# Altium schematic sheet MB_audio.SchDoc: Материнская плата
size 420 x 297 mm; DrawnBy: В.Титов; DocumentNumber: ХХХХ.468179.001 Э3; SheetNumber: 7; SheetTotal: 7; DocumentType: Схема электрическая принципиальная; Title2: Питание процессора
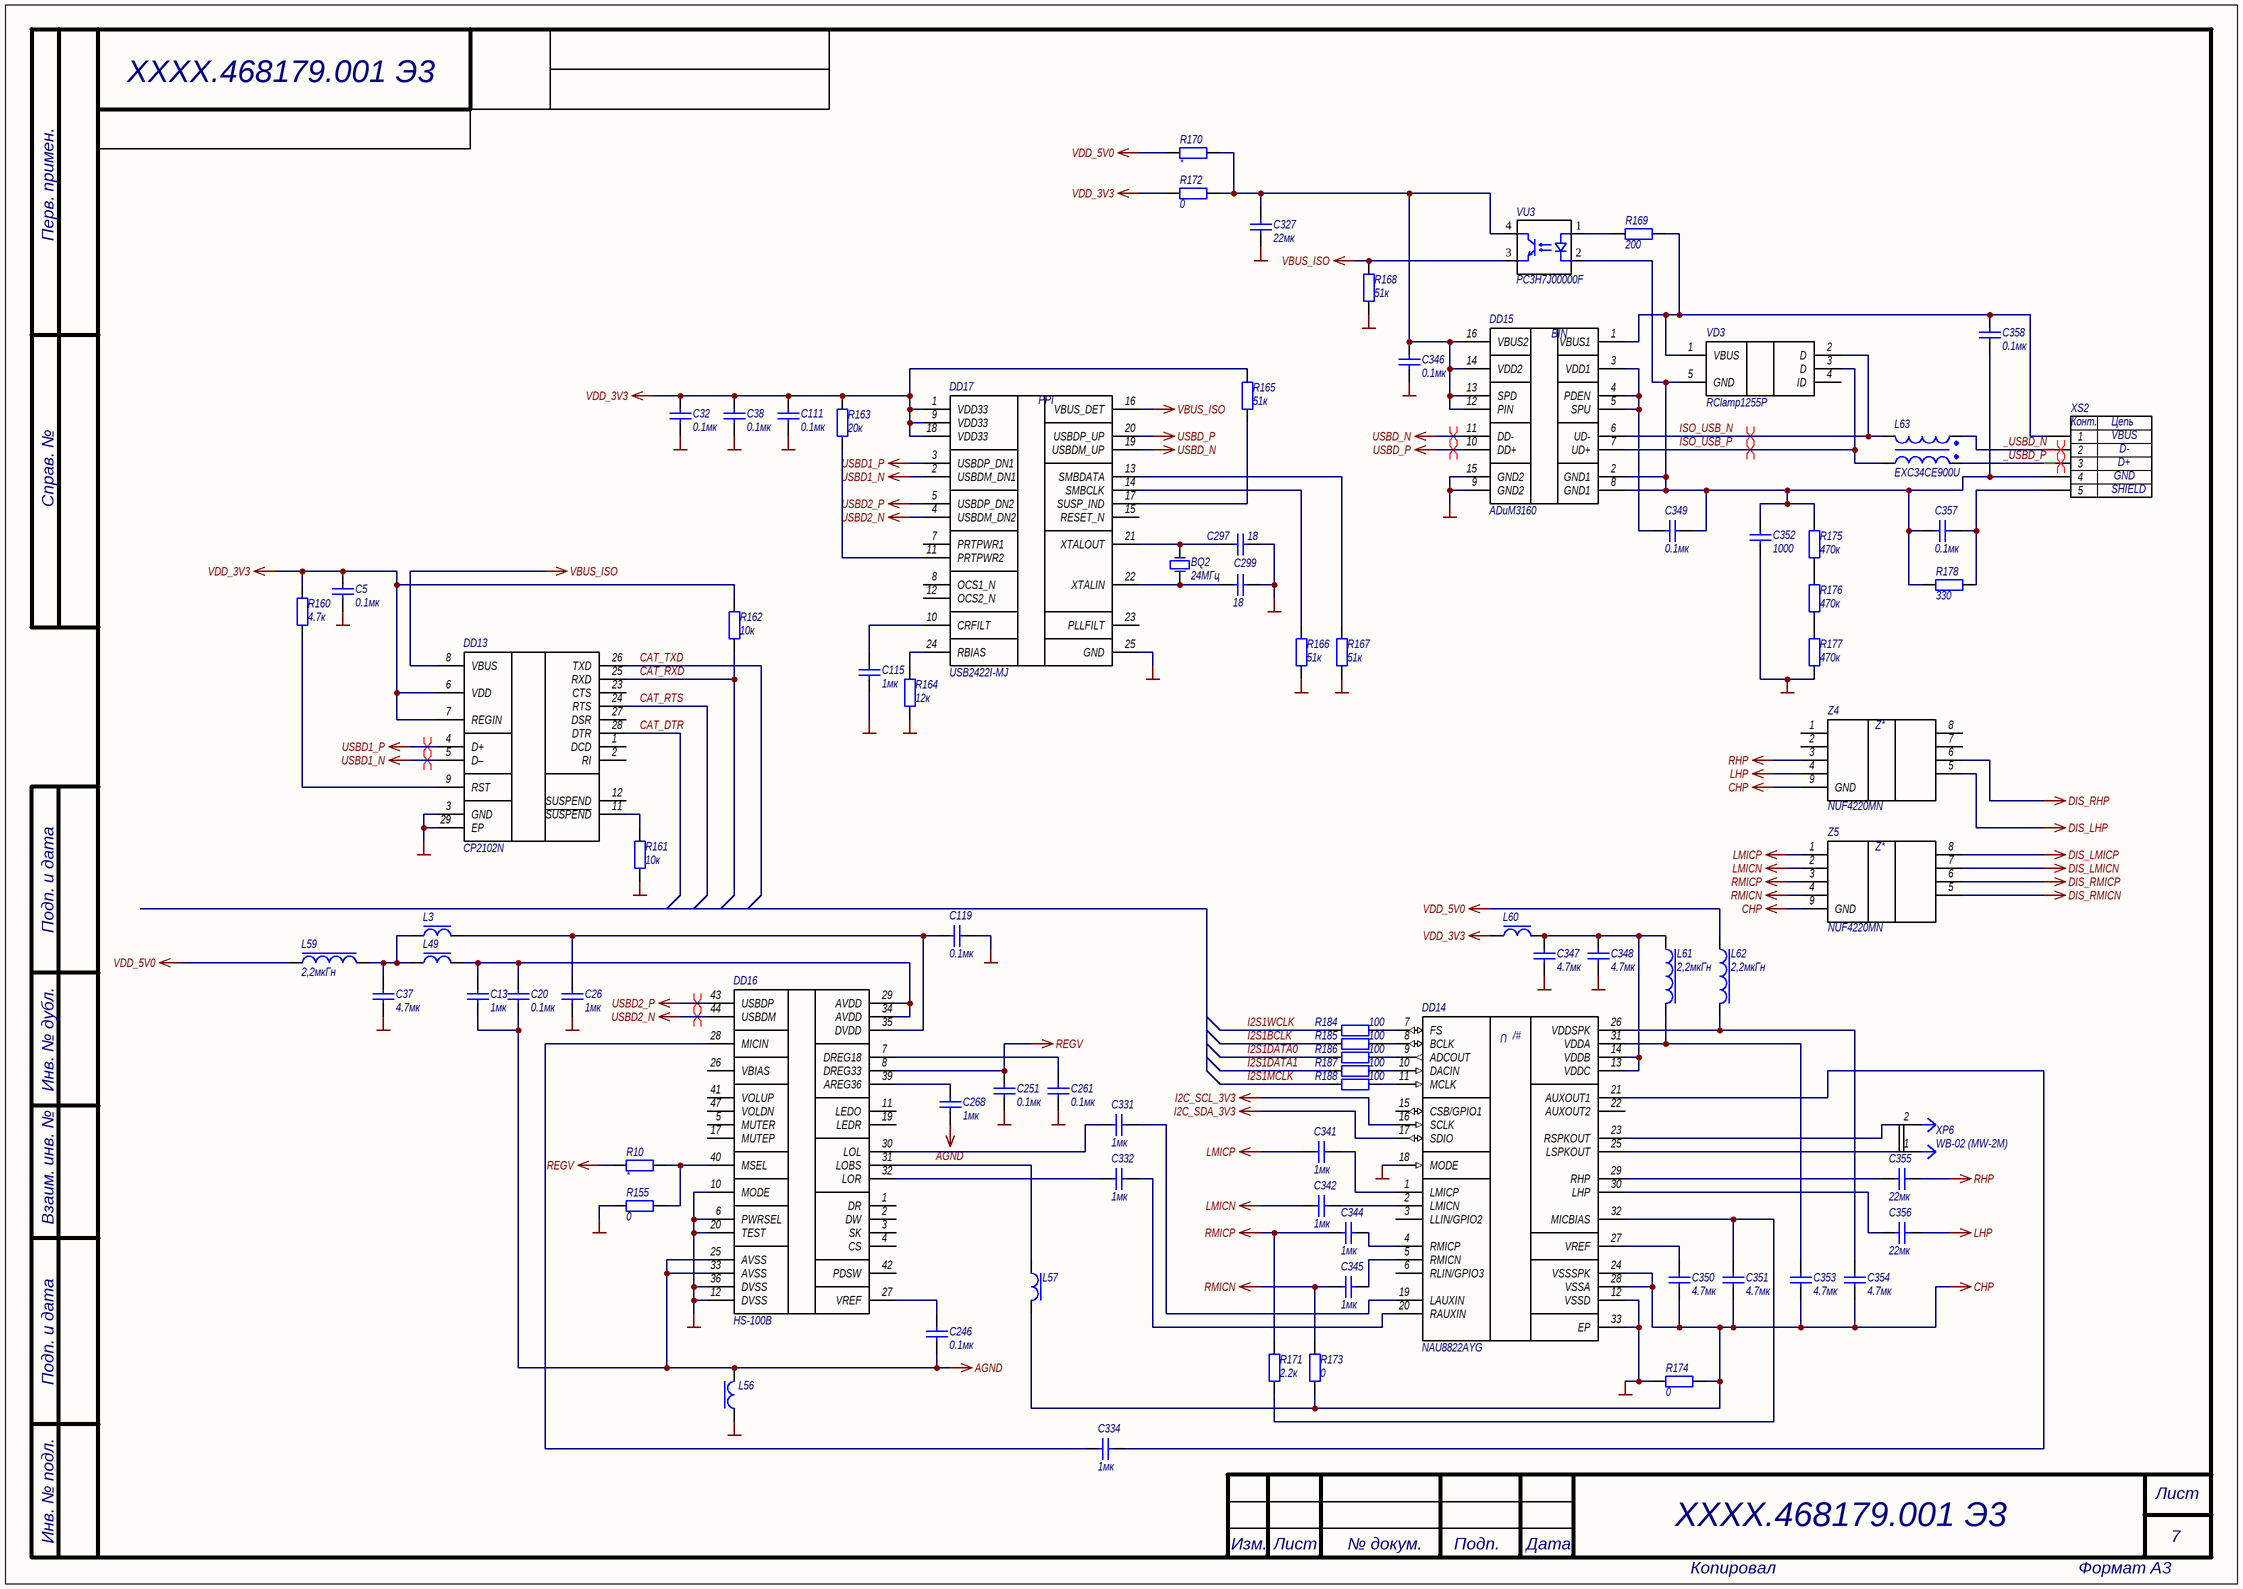
[diagram p0: MB_audio.SchDoc]

## Parts
BQ2  24МГц  [ABRACOM ABM10]
C5  0.1мк  [CAPC1005X06N]
C13  1мк  [CAPC1005X06N]
C20  0.1мк  [CAPC1005X06N]
C26  1мк  [CAPC1005X06N]
C32  0.1мк  [CAPC1005X06N]
C37  4.7мк  [CAPC2012X12L]
C38  0.1мк  [CAPC1005X06N]
C111  0.1мк  [CAPC1005X06N]
C115  1мк  [CAPC1005X06N]
C119  0.1мк  [CAPC1005X06N]
C246  0.1мк  [CAPC1005X06N]
C251  0.1мк  [CAPC1005X06N]
C261  0.1мк  [CAPC1005X06N]
C268  1мк  [CAPC1005X06N]
C297  18  [CAPC1005X06N]
C299  18  [CAPC1005X06N]
C327  22мк  [CAPC2012X12L]
C331  1мк  [CAPC1005X06N]
C332  1мк  [CAPC1005X06N]
C334  1мк  [CAPC1005X06N]
C341  1мк  [CAPC1005X06N]
C342  1мк  [CAPC1005X06N]
C344  1мк  [CAPC1005X06N]
C345  1мк  [CAPC1005X06N]
C346  0.1мк  [CAPC1005X06N]
C347  4.7мк  [CAPC2012X12L]
C348  4.7мк  [CAPC2012X12L]
C349  0.1мк  [CAPC1608X08L]
C350  4.7мк  [CAPC2012X12L]
C351  4.7мк  [CAPC2012X12L]
C352  1000  [CAPRD7.5-9x5]
C353  4.7мк  [CAPC2012X12L]
C354  4.7мк  [CAPC2012X12L]
C355  22мк  [CAPC2012X12L]
C356  22мк  [CAPC2012X12L]
C357  0.1мк  [CAPC1608X08L]
C358  0.1мк  [CAPC1608X08L]
DD13  CP2102N  [QFN50P500X500X80_HS-29N]
DD14  NAU8822AYG  [QFN50P500X500X100_HS-33L]
DD15  ADuM3160  [SOIC127P1030X265-16N]
DD16  HS-100B  [TSQFP50P900X900X160-48N]
DD17  USB2422I-MJ  [QFN50P400X400X80_HS-25L]
L3  BLM18PG121SN1D  [INDC1608X08L]  (value not drawn)
L49  BLM18PG121SN1D  [INDC1608X08L]  (value not drawn)
L56  BLM18PG121SN1D  [INDC1608X08L]  (value not drawn)
L57  BLM18PG121SN1D  [INDC1608X08L]  (value not drawn)
L59  2,2мкГн  [CSAB0420]
L60  BLM18PG121SN1D  [INDC1608X08L]  (value not drawn)
L61  2,2мкГн  [CSAB0420]
L62  2,2мкГн  [CSAB0420]
L63  EXC34CE900U  [EXC34CE900U]
R10  *  [RESC1005X06N]
R155  0  [RESC1005X06N]
R160  4.7к  [RESC1005X06N]
R161  10к  [RESC1005X06N]
R162  10к  [RESC1005X06N]
R163  20к  [RESC1005X06N]
R164  12к  [RESC1005X06N]
R165  51к  [RESC1005X06N]
R166  51к  [RESC1005X06N]
R167  51к  [RESC1005X06N]
R168  51к  [RESC1005X06N]
R169  200  [RESC1005X06N]
R170  *  [RESC1005X06N]
R171  2.2к  [RESC1005X06N]
R172  0  [RESC1005X06N]
R173  0  [RESC1005X06N]
R174  0  [RESC1005X06N]
R175  470к  [RESC1005X06N]
R176  470к  [RESC1005X06N]
R177  470к  [RESC1005X06N]
R178  330  [RESC1005X06N]
R184  100  [RESC1005X06N]
R185  100  [RESC1005X06N]
R186  100  [RESC1005X06N]
R187  100  [RESC1005X06N]
R188  100  [RESC1005X06N]
VD3  RClamp1255P  [SLP2018P6]
VU3  PC3H7J00000F  [SO4-170-1.27]
XP6  WB-02 (MW-2M)  [WB-02 (MW-2M) pitch 2.00mm]
XS2  USBB-1J  [USB2.5-2H4D]  (value not drawn)
Z4  NUF4220MN  [QFN50P200X200X80_HS-9L]
Z5  NUF4220MN  [QFN50P200X200X80_HS-9L]

## Nets
AGND: C13.1 C20.1 C246.1 C268.1 DD16.25(AVSS) DD16.33(AVSS) L56.2
CHP: C350.2 C351.2 C353.2 C354.2 DD14.24(VSSSPK) DD14.28(VSSA) L57.2 R173.1 R174.2 Z4.9(GND) Z5.9(GND)
DIS_LHP: Z4.5
DIS_LMICN: Z5.7
DIS_LMICP: Z5.8
DIS_RHP: Z4.6
DIS_RMICN: Z5.5
DIS_RMICP: Z5.6
GND: C5.1 C26.2 C32.1 C37.2 C38.1 C111.1 C115.1 C119.1 C251.1 C261.1 C297.2 C299.2 C327.1 C346.1 C347.2 C348.2 C352.2 DD13.3(GND) DD13.29(EP) DD14.12(VSSD) DD14.18(MODE) DD14.33(EP) DD15.9(GND2) DD15.15(GND2) DD16.6(PWRSEL) DD16.10(MODE) DD16.12(DVSS) DD16.20(TEST) DD16.36(DVSS) DD17.25(GND) L56.1 R155.2 R161.1 R164.1 R166.1 R167.1 R168.1 R174.1 R177.1
I2C_SCL_3V3: DD14.16(SCLK)
I2C_SDA_3V3: DD14.17(SDIO)
LHP: C356.1 Z4.4
LMICN: C342.1 Z5.2
LMICP: C341.1 Z5.1
REGV: C251.2 DD16.8(DREG33) R10.2
RHP: C355.1 Z4.3
RMICN: C345.1 R173.2 Z5.4
RMICP: C344.1 R171.2 Z5.3
USBD1_N: DD13.5(D–) DD17.2(USBDM_DN1)
USBD1_P: DD13.4(D+) DD17.3(USBDP_DN1)
USBD2_N: DD16.44(USBDM) DD17.4(USBDM_DN2)
USBD2_P: DD16.43(USBDP) DD17.5(USBDP_DN2)
USBD_N: DD15.11(DD-) DD17.19(USBDM_UP)
USBD_P: DD15.10(DD+) DD17.20(USBDP_UP)
VBUS_ISO: DD13.8(VBUS) DD17.16(VBUS_DET) R168.2 VU3.3(E)
VDD_3V3: C5.2 C32.2 C38.2 C111.2 DD13.6(VDD) DD13.7(REGIN) DD17.1(VDD33) DD17.9(VDD33) DD17.18(VDD33) L60.1 R160.2 R162.2 R163.2 R165.2 R172.2
VDD_5V0: L59.1 L62.1 R170.2
_USBD_N: L63.1 XS2.2
_USBD_P: L63.4 XS2.3
CAT_DTR: DD13.28(DTR)
CAT_RTS: DD13.24(RTS)
CAT_RXD: DD13.25(RXD) R162.1
CAT_TXD: DD13.26(TXD)
I2S1BCLK: R185.1
I2S1DATA0: R186.1
I2S1DATA1: R187.1
I2S1MCLK: R188.1
I2S1WCLK: R184.1
ISO_USB_N: DD15.6(UD-) L63.2 VD3.2(D)
ISO_USB_P: DD15.7(UD+) L63.3 VD3.3(D)
NetBQ2_1: BQ2.1(OSC1) C297.1 DD17.21(XTALOUT)
NetBQ2_3: BQ2.3(OSC2) C299.1 DD17.22(XTALIN)
NetC13_2: C13.2 C20.2 DD16.29(AVDD) DD16.34(AVDD) L49.2
NetC26_1: C26.1 C119.2 DD16.35(DVDD) L3.2
NetC37_1: C37.1 L3.1 L49.1 L59.2
NetC115_2: C115.2 DD17.10(CRFILT)
NetC246_2: C246.2 DD16.27(VREF)
NetC261_2: C261.2 DD16.7(DREG18)
NetC268_2: C268.2 DD16.39(AREG36)
NetC327_2: C327.2 C346.2 DD15.12(PIN) DD15.13(SPD) DD15.14(VDD2) DD15.16(VBUS2) R170.1 R172.1 VU3.4(C)
NetC331_1: C331.1 DD16.30(LOL)
NetC331_2: C331.2 DD14.19(LAUXIN)
NetC332_1: C332.1 DD16.32(LOR)
NetC332_2: C332.2 DD14.20(RAUXIN)
NetC334_1: C334.1 DD16.28(MICIN)
NetC334_2: C334.2 DD14.21(AUXOUT1)
NetC341_2: C341.2 DD14.1(LMICP)
NetC342_2: C342.2 DD14.2(LMICN)
NetC344_2: C344.2 DD14.4(RMICP)
NetC345_2: C345.2 DD14.5(RMICN)
NetC347_1: C347.1 C348.1 DD14.13(VDDC) DD14.14(VDDB) L60.2 L61.1
NetC349_1: C349.1 C352.1 C357.2 C358.1 DD15.2(GND1) DD15.8(GND1) R175.2 R178.2 VD3.5(GND) VU3.2(K) XS2.4
NetC349_2: C349.2 DD15.3(VDD1) DD15.4(PDEN) DD15.5(SPU)
NetC350_1: C350.1 DD14.27(VREF)
NetC351_1: C351.1 DD14.32(MICBIAS) R171.1
NetC353_1: C353.1 DD14.31(VDDA) L61.2
NetC354_1: C354.1 DD14.26(VDDSPK) L62.2
NetC355_2: C355.2 DD14.29(RHP)
NetC356_2: C356.2 DD14.30(LHP)
NetC357_1: C357.1 R178.1 XS2.5
NetC358_2: C358.2 DD15.1(VBUS1) R169.1 VD3.1(VBUS) XS2.1
NetDD13_9: DD13.9(RST) R160.1
NetDD13_11: DD13.11(~{SUSPEND}) R161.2
NetDD14_7: DD14.7(FS) R184.2
NetDD14_8: DD14.8(BCLK) R185.2
NetDD14_9: DD14.9(ADCOUT) R186.2
NetDD14_10: DD14.10(DACIN) R187.2
NetDD14_11: DD14.11(MCLK) R188.2
NetDD14_23: DD14.23(RSPKOUT) XP6.2
NetDD14_25: DD14.25(LSPKOUT) XP6.1
NetDD16_31: DD16.31(LOBS) L57.1
NetDD16_40: DD16.40(MSEL) R10.1 R155.1
NetDD17_11: DD17.11(PRTPWR2) R163.1
NetDD17_13: DD17.13(SMBDATA) R167.2
NetDD17_14: DD17.14(SMBCLK) R166.2
NetDD17_17: DD17.17(SUSP_IND) R165.1
NetDD17_24: DD17.24(RBIAS) R164.2
NetR169_2: R169.2 VU3.1(A)
NetR175_1: R175.1 R176.2
NetR176_1: R176.1 R177.2

Not connected (* = marked no-connect by the designer): DD13 1(DCD) 2(RI) 12(SUSPEND) 23(CTS) 27(DSR); DD14 3(LLIN/GPIO2) 6(RLIN/GPIO3) 15(CSB/GPIO1) 22(AUXOUT2); DD16 1(DR) 2(DW) 3(SK) 4(CS) 5(MUTER) 11(LEDO) 17(MUTEP) 19(LEDR) 26(VBIAS) 41(VOLUP) 42(PDSW) 47(VOLDN); DD17 7(PRTPWR1) 8(OCS1_N) 12(OCS2_N) 15(RESET_N) 23(PLLFILT); VD3 4(ID); Z4 1 2 7 8

## Layout directives
differential pair: _USBD_N, _USBD_P, ISO_USB_N, ISO_USB_P, USBD1_N, USBD1_P, USBD2_N, USBD2_P, USBD_N, USBD_P

## Notes on the sheet
- Перв. примен.
- Справ. №
- Подп. и дата
- Инв. № дубл.
- Взаим. инв. №
- Инв. № подл.
- Лист
- Изм.
- № докум.
- Подп.
- Дата
- Копировал
- Формат А3
- (in symbol Микросхема ADuM3160) BIN
- (in symbol Микросхема NAU8822AYG) U; /#
- (in symbol Микросхема USB2422I-MJ) PPI
- (in symbol Соединитель USBB-1J) Конт.; Цепь; VBUS; D-; D+; GND; SHIELD
- (in symbol Фильтр EMI NUF4220MN) Z*

## Library data of the parts
BQ2 = Кварц ABM10AIG-24.000MHZ-4Z-T3: Резонатор кварцевый; Manufacturer: ABRACON; Tolerance: ±50 ppm; Value: 24МГц
C5 C20 C32 C38 C111 C119 C246 C251 C261 C346 = Кер.ЧИП конд. 0402 0.1мкФ X7R 10%, 16В: Кер. ЧИП-конденсатор; Power/Voltage: 16В; TKE: X7R; Tolerance: ±10%; PackageReference: 0402; Value: 0.1мк
C13 C26 C115 C268 C331 C332 C334 C341 C342 C344 C345 = Кер.ЧИП конд. 0402 1мкФ X5R 10%, 10В: Кер. ЧИП-конденсатор; Power/Voltage: 10В; TKE: X5R; Tolerance: ±10%; Value: 1мк; PackageReference: 0402
C37 C347 C348 C350 C351 C353 C354 = Кер.ЧИП конд. 0805 4,7мкФ X5R 20% 16В: Кер. ЧИП-конденсатор; Manufacturer: Murata; ManufacturerPartNumber: GRM21BR61A476ME15L; Power/Voltage: 16В; TKE: X5R; Tolerance: ±20%; Value: 4.7мк
C297 C299 = Кер.ЧИП конд. 0402 18пФ NPO 5%, 50В: Кер. ЧИП-конденсатор; Power/Voltage: 50В; TKE: NPO; Tolerance: ±5%; Value: 18; PackageReference: 0402
C327 = Кер.ЧИП конд. 0805 22мкФ X5R 10% 16В: Кер. ЧИП-конденсатор; Manufacturer: TDK; ManufacturerPartNumber: C2012X5R1C226KT; Power/Voltage: 16В; TKE: X5R; Tolerance: ±10%; Value: 22мк
C349 C357 C358 = Кер.ЧИП конд. 0603 0.1мкФ X7R 10% 50В: Кер. ЧИП-конденсатор; Manufacturer: Murata; ManufacturerPartNumber: GRM188R71H104KA93D; Power/Voltage: 50В; TKE: X7R; Tolerance: ±10%; Value: 0.1мк
C352 = Конденсатор керамический защищенный 1000pF 250V AC (DE1E3KX102MA4BN01F): Защищенные конденсаторы 1000pF 250Vrms 20% L/S=10mm Bulk long; Manufacturer: MURATA; Power/Voltage: 250VAC; TKE: X1Y1; Tolerance: ±10%; Published: 8-Jun-2000; LatestRevisionDate: 17-Jul-2002; LatestRevisionNote: Re-released for DXP Platform.; Publisher: Altium Limited; PackageReference: Type KX Small Size; ManufacturerPartNumber: DE1E3KX102MA4BN01F; Value: 1000
C355 C356 = Кер.ЧИП конд. 0805 22мкФ X5R 10% 16В: Кер. ЧИП-конденсатор; Manufacturer: TDK; ManufacturerPartNumber: C2012X5R1C226KT; Power/Voltage: 16В; Tolerance: ±10%; TKE: X5R; Value: 22мк
DD13 = Микросхема CP2102N-A02-GQFN28: Single-Chip USB-to-UART Data Transfer; Manufacturer: Silicon Labs; Value: CP2102N; ComponentLink1Description: datasheet; ComponentLink1URL: https://www.silabs.com/documents/public/data-sheets/cp2102n-datasheet.pdf
DD14 = Микросхема NAU8822AYG: 24-bit Stereo Audio Codec with Speaker Driver; Manufacturer: NUVOTON; Value: NAU8822AYG
DD15 = Микросхема ADuM3160: Full/Low Speed 2.5 kV USB Digital Isolator /; Manufacturer: AD; Value: ADuM3160; ComponentLink1Description: datasheet; ComponentLink1URL: https://www.analog.com/media/en/technical-documentation/data-sheets/ADuM5210_5211_5212.pdf
DD16 = Микросхема HS-100B: A Highly Integrated USB Audio Single Chip; Manufacturer: Cmedia; Value: HS-100B; ComponentLink1Description: datasheet
DD17 = Микросхема USB2422I-MJ: 2-Port USB 2.0 Hi-Speed Hub Controller; Manufacturer: Microchip; Value: USB2422I-MJ; ComponentLink1Description: datasheet; ComponentLink1URL: https://ww1.microchip.com/downloads/en/devicedoc/00001726b.pdf
L3 L49 L56 L57 L60 = ЧИП дроссель 0603 BLM18PG121SN1D: SMD EMI Suppression Filter EMIFIL; Manufacturer: Murata; ManufacturerPartNumber: BLM18PG121SN1D; Value: BLM18PG121SN1D
L59 L61 L62 = ЧИП индуктивность CSAB0420-2R2M: Molding Power Choke; Manufacturer: Vishay; ManufacturerPartNumber: IHLP1616ABER1R0M11; Value: 2,2мкГн
L63 = ЧИП синфазный фильтр 0805 EXC34CE900U: Common Mode Noise Filters EXC34CG/CE type; Manufacturer: Panasonic; ManufacturerPartNumber: EXC34CE900U; Value: EXC34CE900U; ComponentLink1Description: datasheet; ComponentLink1URL: https://industrial.panasonic.com/cdbs/www-data/pdf/AWE0000/AWE0000C276.pdf
R10 R170 = Чип резистор 0402 *: ЧИП-резистор; Tolerance: ±5%; TKE: 100 ppm/°С; PackageReference: 0402; Value: *
R155 R172-R174 = Чип резистор 0402 0 Ом: ЧИП-резистор; Tolerance: ±5%; TKE: 100 ppm/°С; PackageReference: 0402; Value: 0
R160 = Чип резистор 0402 4,7 кОм, 5%: ЧИП-резистор; Tolerance: ±5%; TKE: 100 ppm/°С; PackageReference: 0402; Value: 4.7к
R161 R162 = Чип резистор 0402 10 кОм, 5%: ЧИП-резистор; Tolerance: ±5%; TKE: 100 ppm/°С; PackageReference: 0402; Value: 10к
R163 = Чип резистор 0402 20 кОм, 5%: ЧИП-резистор; Tolerance: ±5%; TKE: 100 ppm/°С; PackageReference: 0402; Value: 20к
R164 = Чип резистор 0402 12 кОм, 5%: ЧИП-резистор; Tolerance: ±5%; TKE: 100 ppm/°С; PackageReference: 0402; Value: 12к
R165-R168 = Чип резистор 0402 51 кОм, 5%: ЧИП-резистор; Tolerance: ±5%; TKE: 100 ppm/°С; PackageReference: 0402; Value: 51к
R169 = Чип резистор 0402 200 Ом, 5%: ЧИП-резистор; Tolerance: ±5%; TKE: 100 ppm/°С; PackageReference: 0402; Value: 200
R171 = Чип резистор 0402 2,2 кОм, 5%: ЧИП-резистор; Tolerance: ±5%; TKE: 100 ppm/°С; PackageReference: 0402; Value: 2.2к
R175-R177 = Чип резистор 0402 470 кОм, 5%: ЧИП-резистор; Tolerance: ±5%; TKE: 100 ppm/°С; PackageReference: 0402; Value: 470к
R178 = Чип резистор 0402 330 Ом, 5%: ЧИП-резистор; Tolerance: ±5%; TKE: 100 ppm/°С; PackageReference: 0402; Value: 330
R184-R188 = Чип резистор 0402 100 Ом, 5%: ЧИП-резистор; Tolerance: ±5%; TKE: 100 ppm/°С; PackageReference: 0402; Value: 100
VD3 = Диодная сборка RClamp1255P: Low Capacitance RClamp Surge Protection for uUSB Interfaces; Manufacturer: SEMTECH; PackageReference: SLP1510N6; Value: RClamp1255P
VU3 = Оптопара транзисторная PC3H7J00000F: Mini-falt Package, General Purpose Half Pitch Photocouper; PackageReference: SOP-4; ComponentLink1Description: Manufacturer Link; ComponentLink1URL: http://www.vishay.com/optocouplers/list/product-83640/; ComponentLink2Description: Datasheet; ComponentLink2URL: http://www.vishay.com/docs/83640/83640.pdf; Value: PC3H7J00000F
XP6 = Соединитель WB-02 (MW-2M): Соединитель; Value: WB-02 (MW-2M)
XS2 = Соединитель USBB-1J: Universal Serial Bus (USB) Shielded I/O Receptacle, Right Angle, Type B; Manufacturer: Connfly; Value: USBB-1J
Z4 Z5 = Фильтр EMI NUF4220MN: ESD/EMI Protection  for Audio Interfaces; Manufacturer: onsemi; PackageReference: DFN8; Value: NUF4220MN